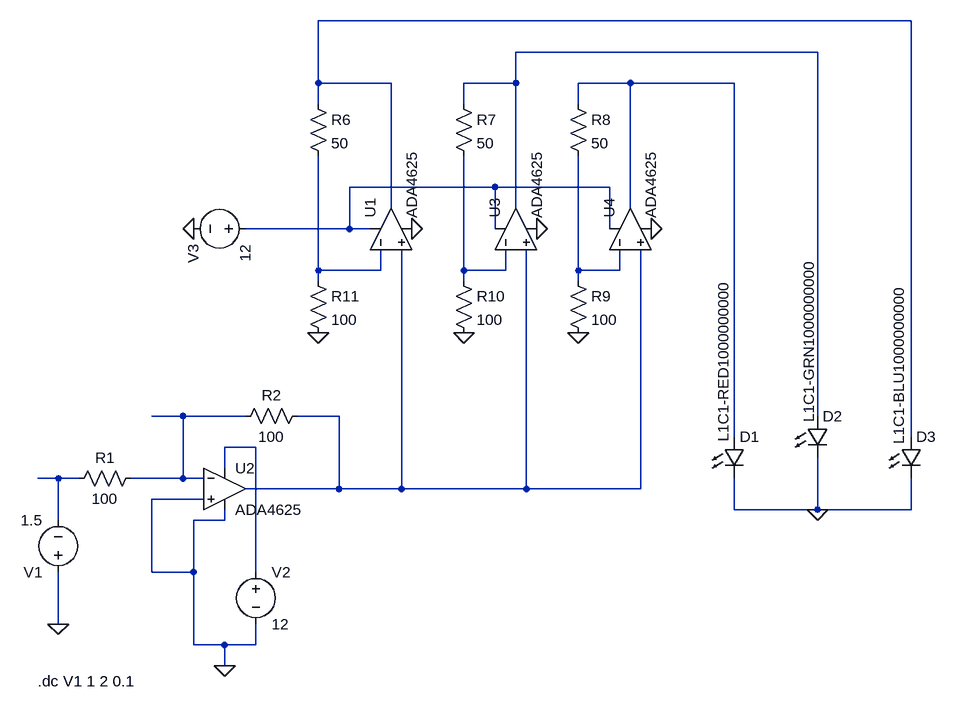
[diagram p0: schematic Draft2.asc]
Draft2.asc, the LTspice schematic file:
Version 4
SHEET 1 1376 680
WIRE 1152 -576 240 -576
WIRE 1008 -528 544 -528
WIRE 240 -480 240 -576
WIRE 352 -480 240 -480
WIRE 544 -480 544 -528
WIRE 544 -480 464 -480
WIRE 720 -480 640 -480
WIRE 880 -480 720 -480
WIRE 240 -448 240 -480
WIRE 464 -448 464 -480
WIRE 640 -448 640 -480
WIRE 512 -320 288 -320
WIRE 688 -320 512 -320
WIRE 352 -288 352 -480
WIRE 544 -288 544 -480
WIRE 720 -288 720 -480
WIRE 288 -256 288 -320
WIRE 288 -256 128 -256
WIRE 320 -256 288 -256
WIRE 512 -256 512 -320
WIRE 688 -256 688 -320
WIRE 240 -192 240 -368
WIRE 336 -192 336 -224
WIRE 336 -192 240 -192
WIRE 464 -192 464 -368
WIRE 528 -192 528 -224
WIRE 528 -192 464 -192
WIRE 640 -192 640 -368
WIRE 704 -192 704 -224
WIRE 704 -192 640 -192
WIRE 240 -176 240 -192
WIRE 464 -176 464 -192
WIRE 640 -176 640 -192
WIRE 32 32 -16 32
WIRE 128 32 32 32
WIRE 272 32 208 32
WIRE 1008 32 1008 -528
WIRE 880 64 880 -480
WIRE 1152 64 1152 -576
WIRE 144 80 96 80
WIRE 96 112 96 80
WIRE -160 128 -192 128
WIRE -128 128 -160 128
WIRE 32 128 32 32
WIRE 32 128 -48 128
WIRE 64 128 32 128
WIRE 272 144 272 32
WIRE 272 144 128 144
WIRE 368 144 368 -224
WIRE 368 144 272 144
WIRE 560 144 560 -224
WIRE 560 144 368 144
WIRE 736 144 736 -224
WIRE 736 144 560 144
WIRE 64 160 -16 160
WIRE 880 176 880 128
WIRE 1008 176 1008 96
WIRE 1008 176 880 176
WIRE 1152 176 1152 128
WIRE 1152 176 1008 176
WIRE -160 192 -160 128
WIRE 96 192 96 176
WIRE 96 192 48 192
WIRE -16 272 -16 160
WIRE 48 272 48 192
WIRE 48 272 -16 272
WIRE 144 272 144 80
WIRE -160 352 -160 272
WIRE 48 384 48 272
WIRE 96 384 48 384
WIRE 144 384 144 352
WIRE 144 384 96 384
WIRE 96 416 96 384
FLAG -160 352 0
FLAG 96 416 0
FLAG 1008 176 0
FLAG 384 -256 0
FLAG 752 -256 0
FLAG 576 -256 0
FLAG 48 -256 0
FLAG 640 -96 0
FLAG 464 -96 0
FLAG 240 -96 0
SYMBOL voltage -160 288 R180
WINDOW 123 0 0 Left 0
WINDOW 39 0 0 Left 0
SYMATTR InstName V1
SYMATTR Value 1.5
SYMBOL res 224 16 R90
WINDOW 0 0 56 VBottom 2
WINDOW 3 32 56 VTop 2
SYMATTR InstName R2
SYMATTR Value 100
SYMBOL voltage 144 256 R0
WINDOW 123 0 0 Left 0
WINDOW 39 0 0 Left 0
SYMATTR InstName V2
SYMATTR Value 12
SYMBOL OpAmps\\ADA4625 96 80 R0
SYMATTR InstName U2
SYMBOL voltage 144 -256 R90
WINDOW 0 24 96 Left 2
WINDOW 3 24 16 Left 2
WINDOW 123 0 0 Left 0
WINDOW 39 0 0 Left 0
SYMATTR InstName V3
SYMATTR Value 12
SYMBOL LED 864 64 R0
WINDOW 3 -1 8 VLeft 2
SYMATTR Value L1C1-RED1000000000
SYMATTR InstName D1
SYMBOL LED 992 32 R0
WINDOW 3 3 10 VLeft 2
SYMATTR Value L1C1-GRN1000000000
SYMATTR InstName D2
SYMBOL LED 1136 64 R0
WINDOW 3 -3 12 VLeft 2
SYMATTR Value L1C1-BLU1000000000
SYMATTR InstName D3
SYMBOL res -32 112 R90
WINDOW 0 0 56 VBottom 2
WINDOW 3 32 56 VTop 2
SYMATTR InstName R1
SYMATTR Value 100
SYMBOL OpAmps\\ADA4625 288 -256 R270
SYMATTR InstName U1
SYMBOL OpAmps\\ADA4625 480 -256 R270
SYMATTR InstName U3
SYMBOL OpAmps\\ADA4625 656 -256 R270
SYMATTR InstName U4
SYMBOL res 224 -464 R0
SYMATTR InstName R6
SYMATTR Value 50
SYMBOL res 448 -464 R0
SYMATTR InstName R7
SYMATTR Value 50
SYMBOL res 624 -464 R0
SYMATTR InstName R8
SYMATTR Value 50
SYMBOL res 624 -192 R0
SYMATTR InstName R9
SYMATTR Value 100
SYMBOL res 448 -192 R0
SYMATTR InstName R10
SYMATTR Value 100
SYMBOL res 224 -192 R0
SYMATTR InstName R11
SYMATTR Value 100
TEXT -192 440 Left 2 !.dc V1 1 2 0.1

The netlist it stands for:
* Draft2.asc
V1 0 N011 1.5
R2 N009 N008 100
V2 N010 0 12
XU2 0 N008 N010 0 N009 ADA4625  ; pins In+ In- V+ V- OUT
V3 N004 0 12
D1 N003 0 L1C1-RED1000000000
D2 N002 0 L1C1-GRN1000000000
D3 N001 0 L1C1-BLU1000000000
R1 N008 N011 100
XU1 N009 N005 N004 0 N001 ADA4625  ; pins In+ In- V+ V- OUT
XU3 N009 N006 N004 0 N002 ADA4625  ; pins In+ In- V+ V- OUT
XU4 N009 N007 N004 0 N003 ADA4625  ; pins In+ In- V+ V- OUT
R6 N001 N005 50
R7 N002 N006 50
R8 N003 N007 50
R9 N007 0 100
R10 N006 0 100
R11 N005 0 100
.model D D
.lib standard.dio
.dc V1 1 2 0.1
.backanno
.end